# EAGLE schematic mpu-6050 (EAGLE 8.1.0)
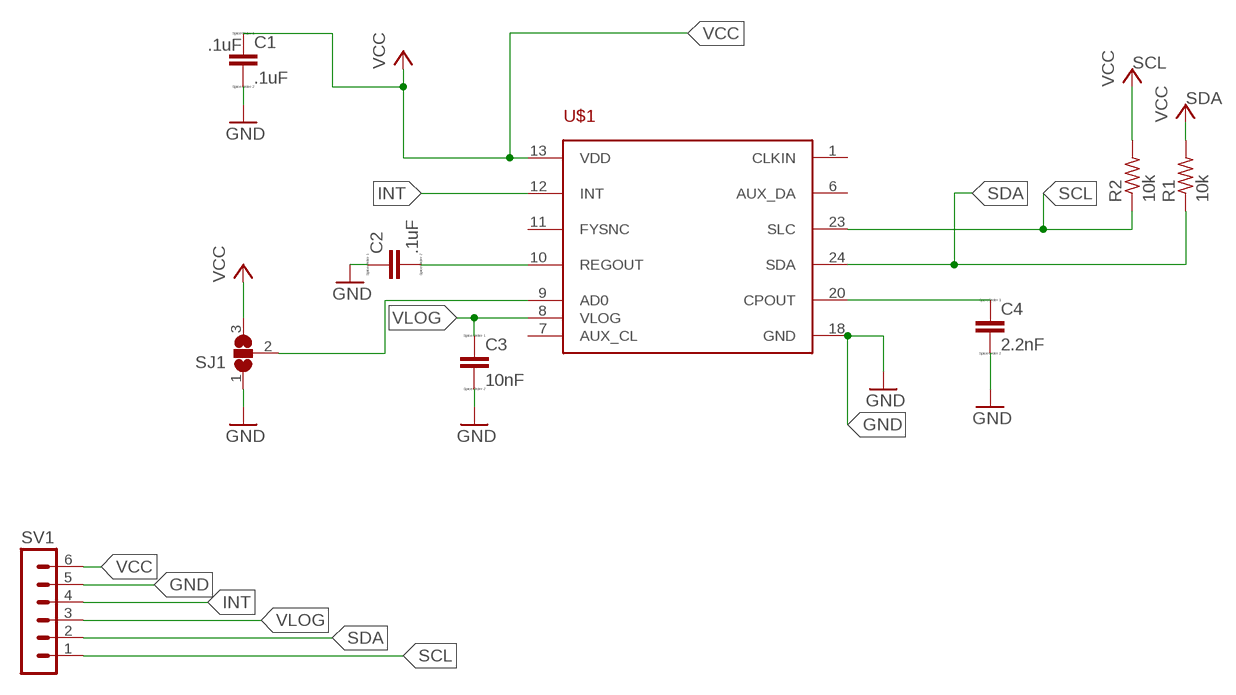
[diagram p0: schematic, sheet 1]

## Parts
C1  .1uF  CC0402  [C0402]
C2  .1uF  CC0402  [C0402]
C3  10nF  CC0402  [C0402]
C4  2.2nF  CC0402  [C0402]
R1  10k  R-US_R0603  [R0603]
R2  10k  R-US_R0603  [R0603]
SJ1  SJ2W  [SJ_2]
SV1  MA06-1  [MA06-1]
U$1  MPU-6050  [QFN24-4X4]

## Nets
GND: C1.2 C2.1 C3.2 C4.2 SJ1.1 SV1.5 U$1.18(GND)
INT: SV1.4 U$1.12(INT)
N$2: C4.1 U$1.20(CPOUT)
N$3: C2.2 U$1.10(REGOUT)
N$5: SJ1.2 U$1.9(AD0)
SCL: R2.1 SV1.1 U$1.23(SLC)
SDA: R1.1 SV1.2 U$1.24(SDA)
VCC: C1.1 R1.2 R2.2 SJ1.3 SV1.6 U$1.13(VDD)
VLOG: C3.1 SV1.3 U$1.8(VLOG)
Unconnected: U$1.1(CLKIN) U$1.6(AUX_DA) U$1.7(AUX_CL) U$1.11(FYSNC)

## Library data of the parts
C1 = eagle-ltspice:C: CAPACITOR, European symbol; SPICEMODEL: NONE; SPICEPREFIX: .1uF
C2-C4 = eagle-ltspice:C: CAPACITOR, European symbol; SPICEMODEL: NONE; SPICEPREFIX: C
R1 = rcl:R-US_: RESISTOR, American symbol; R2: 10k
R2 = rcl:R-US_: RESISTOR, American symbol
SJ1 = jumper:SJ2W: SMD solder JUMPER
SV1 = con-lstb:MA06-1: PIN HEADER; OC_FARNELL: unknown; OC_NEWARK: unknown
U$1 = KevinKuwata1:MPU-6050